# Altium project Rings.PrjPcb
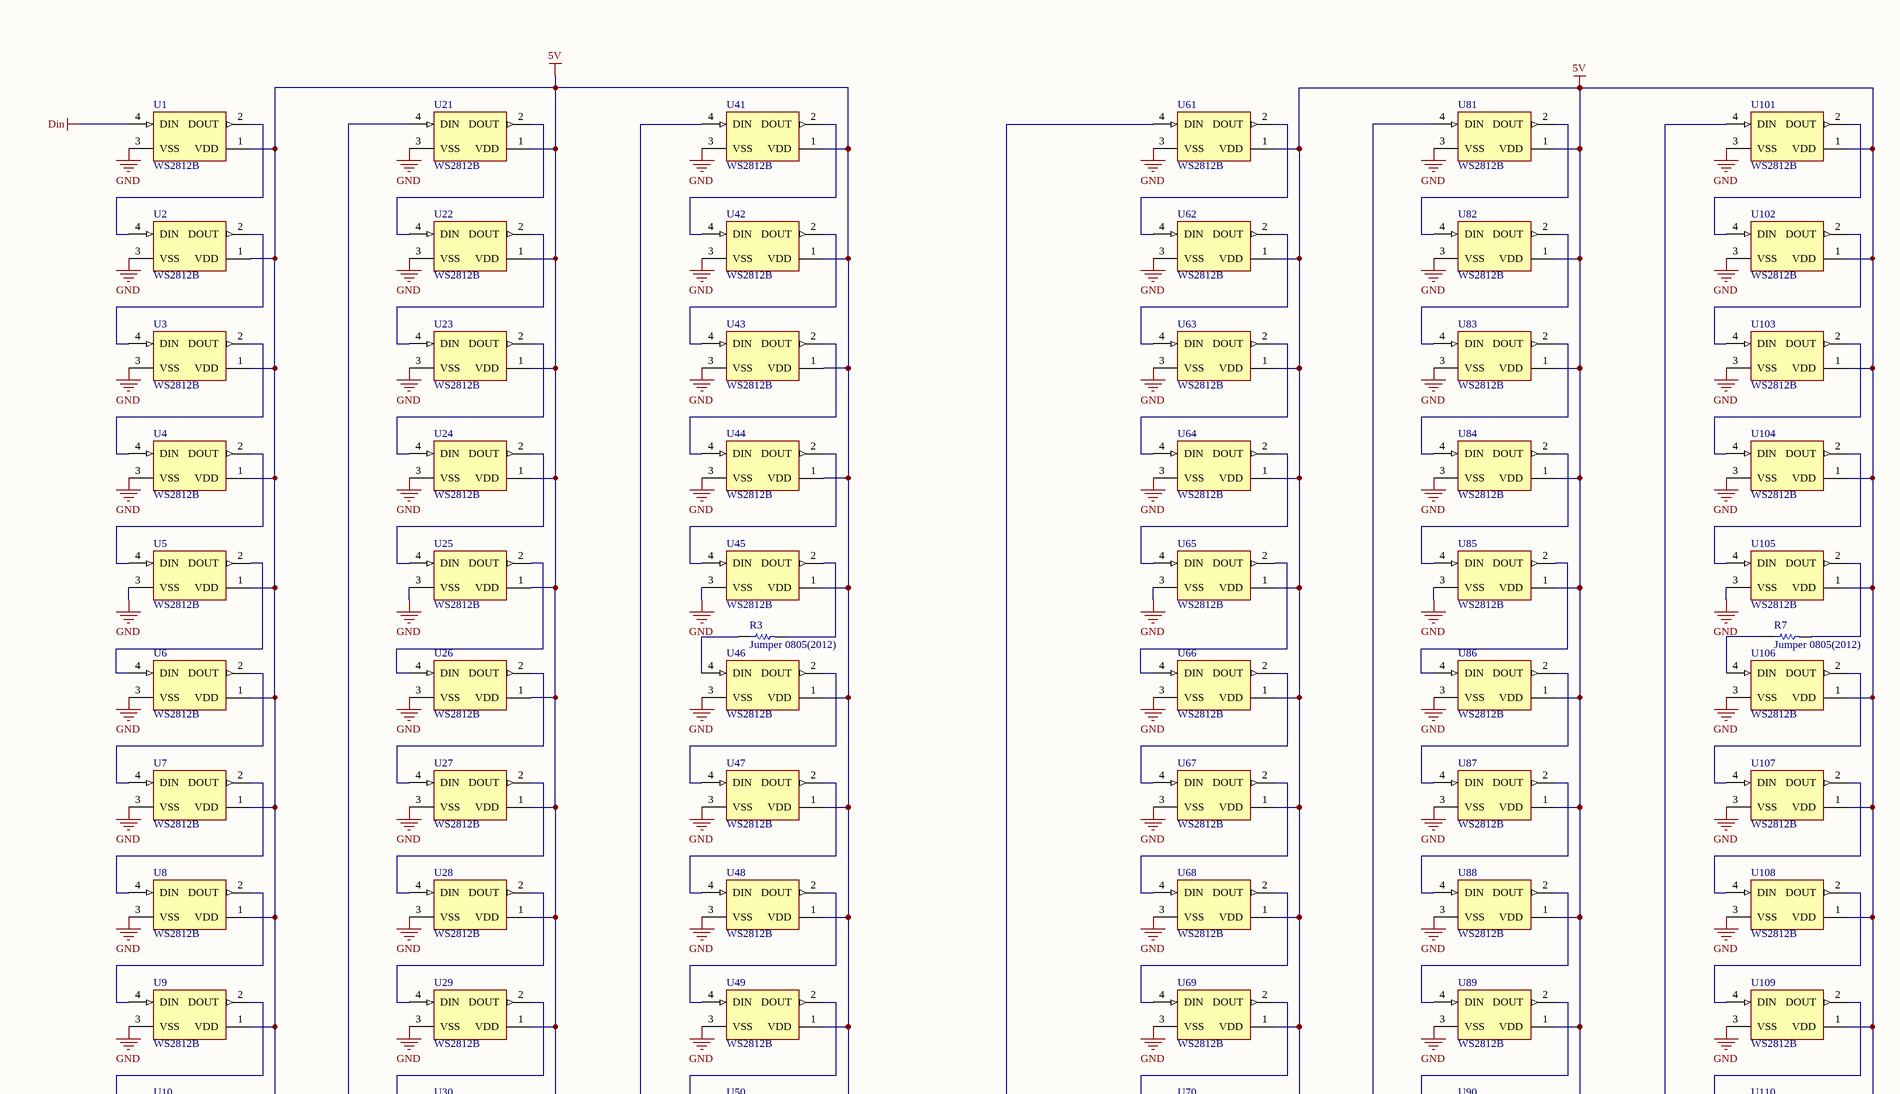
[diagram p0: ring.SchDoc, top left]
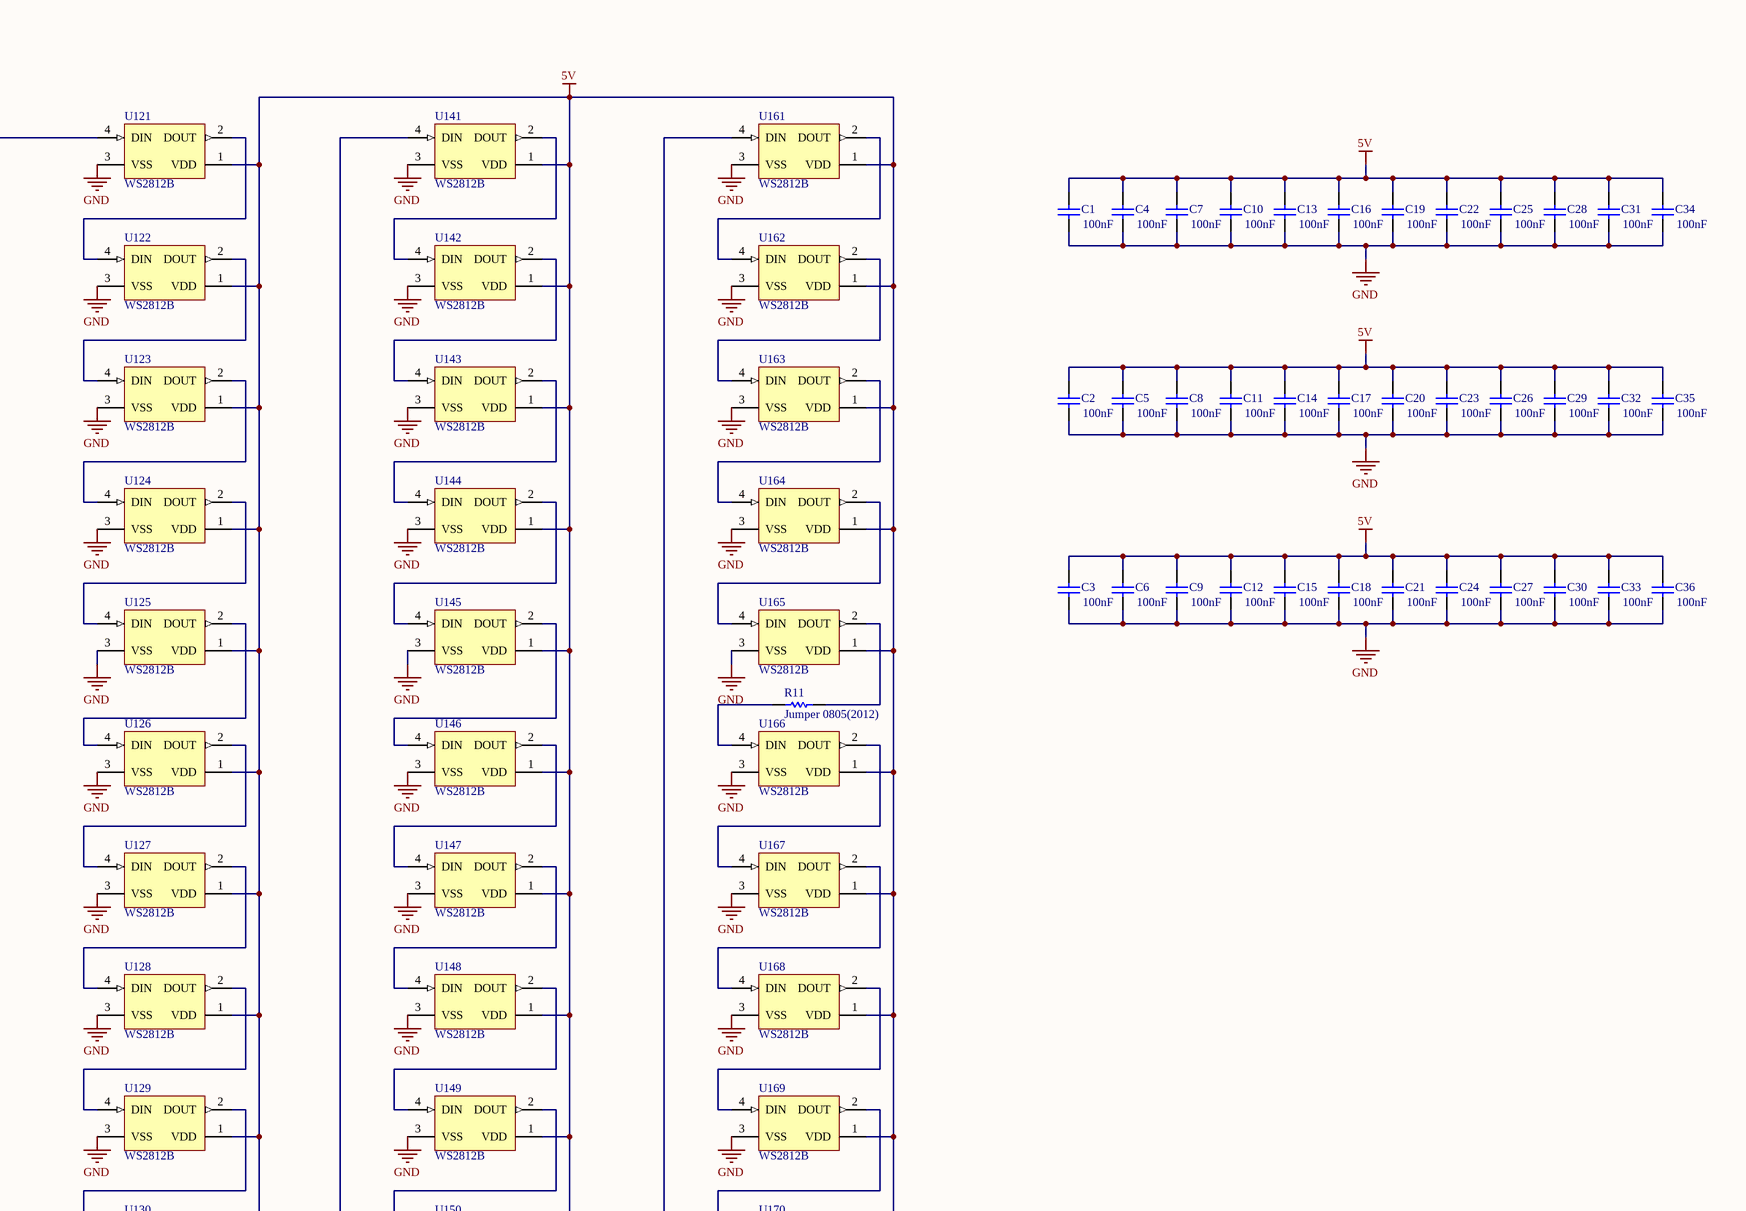
[diagram p1: ring.SchDoc, top right]
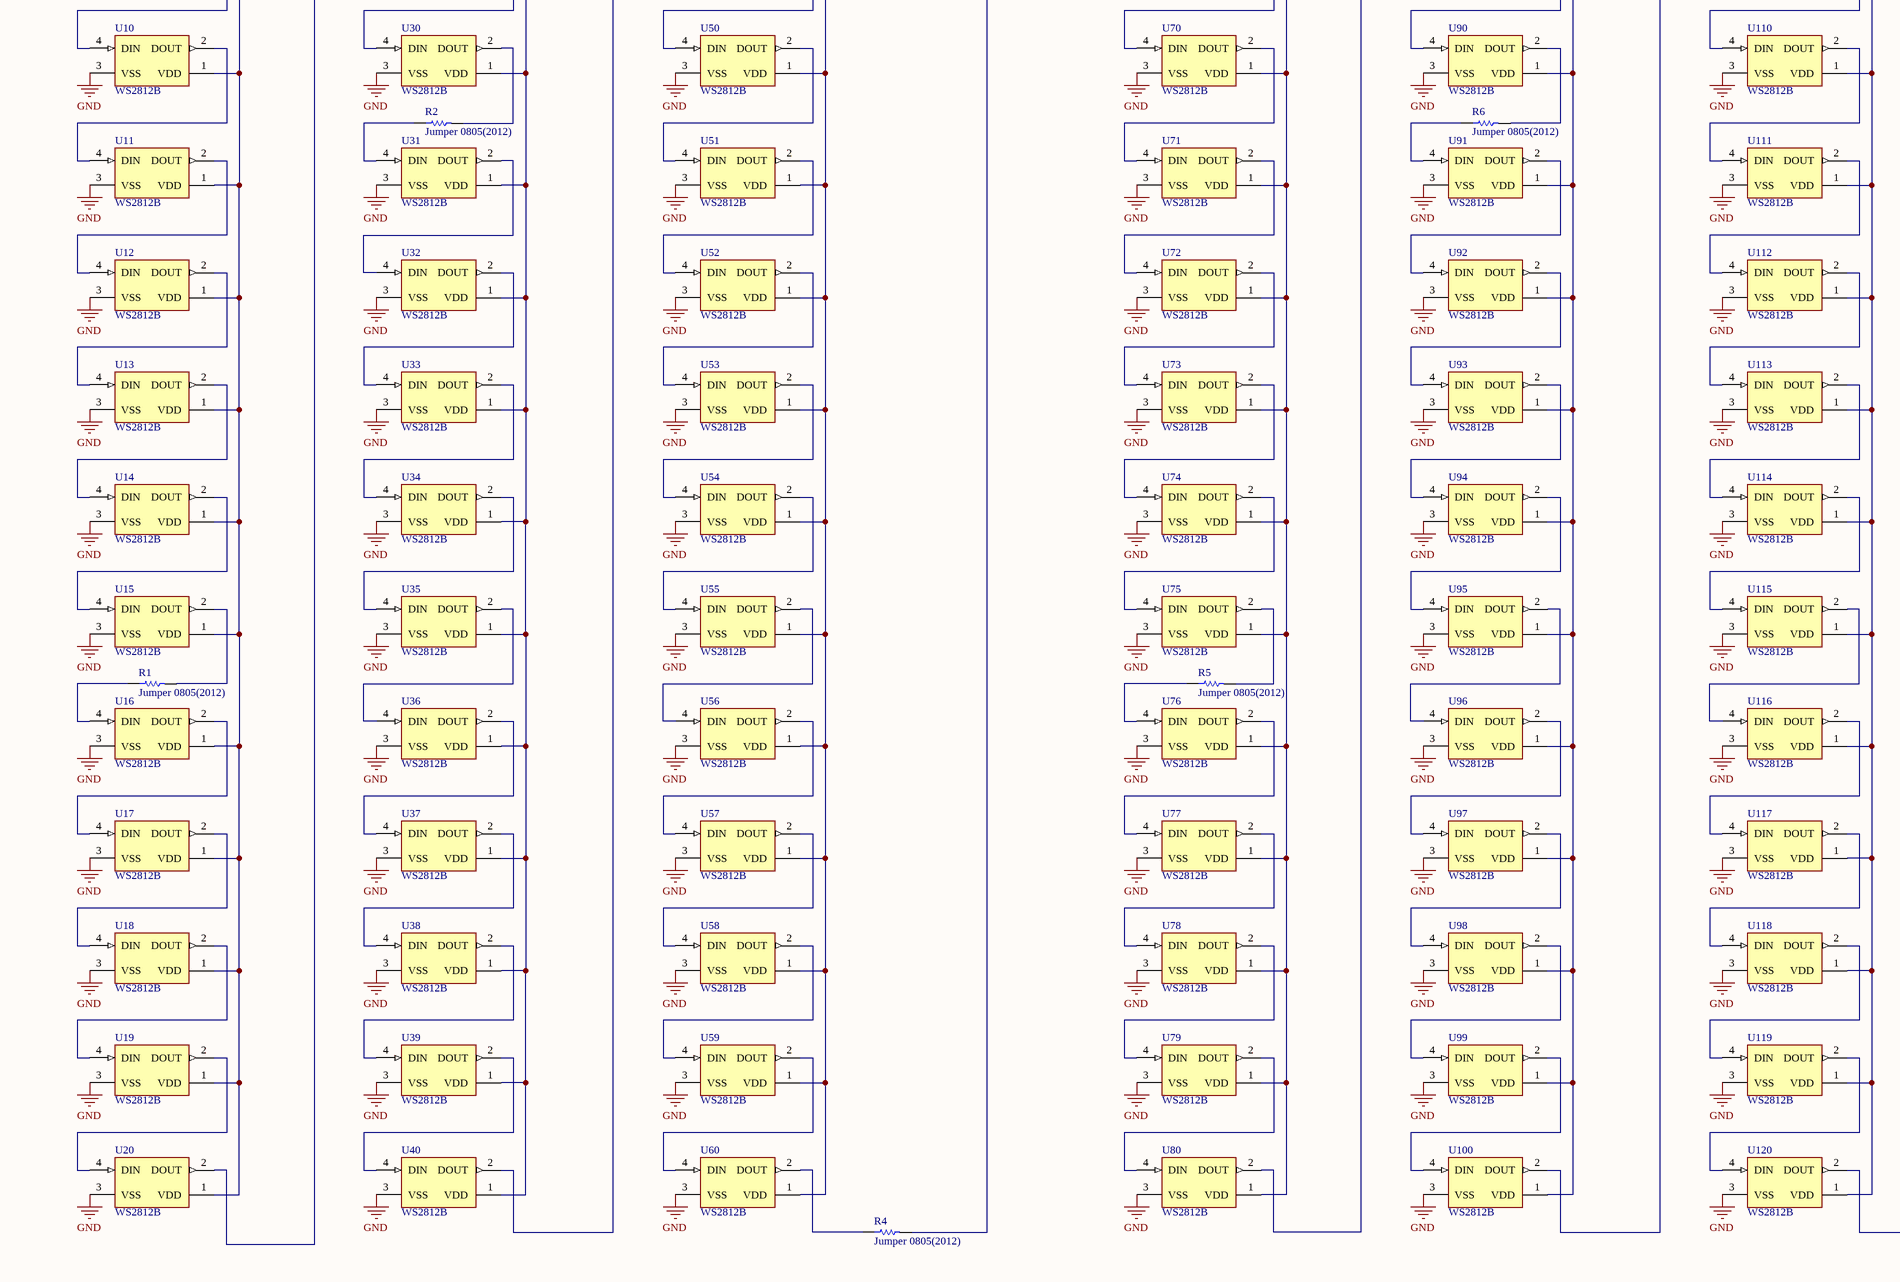
[diagram p2: ring.SchDoc, bottom left]
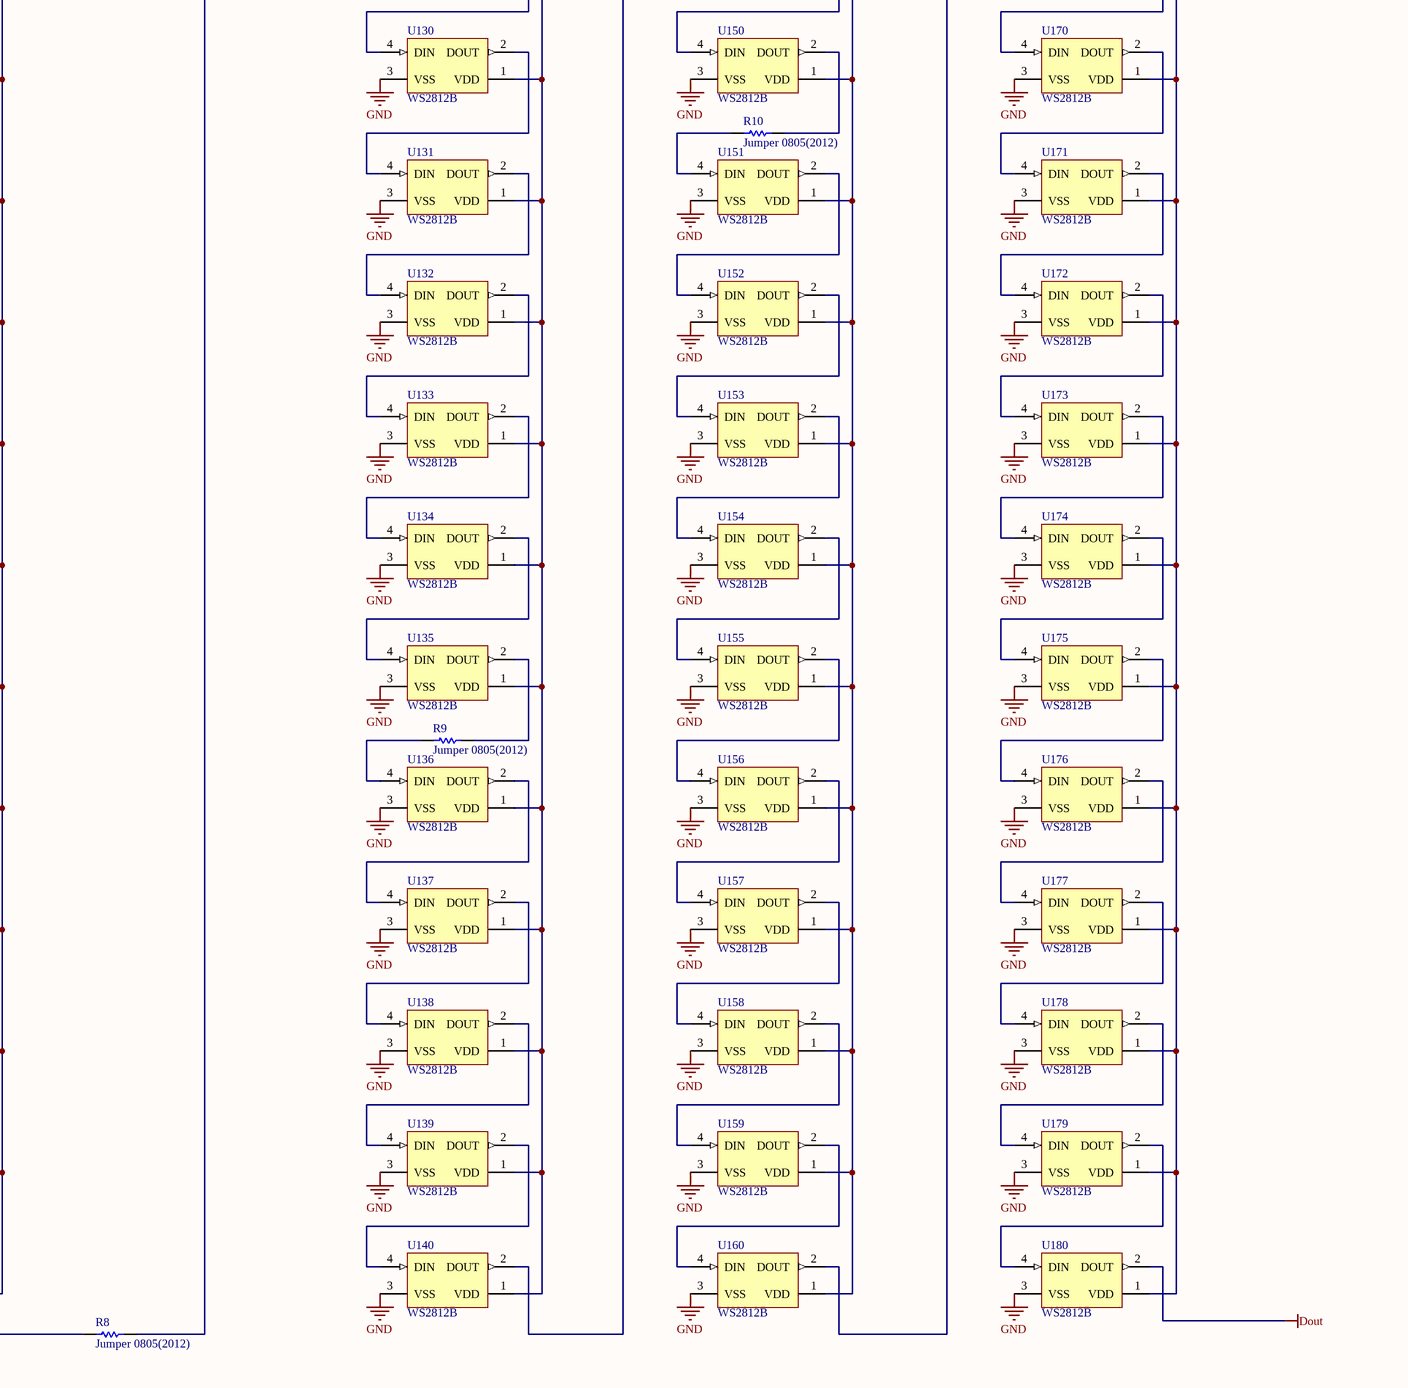
[diagram p3: ring.SchDoc, bottom right]
1 sheet, 227 parts. Net scope: global (net labels, ports and power ports of the same name join across sheets).
Board file: ring.PcbDoc

## Sheet ring.SchDoc: Rings
size A1; ApprovedBy: Othniel Konan; CheckedBy: Othniel Konan; Author: Othniel Konan; DrawnBy: Othniel Konan; Engineer: Othniel Konan; Address1: NPSC; Address2: Othniel Konan; Address3: ECE 2017; DocumentNumber: 1; Revision: 1.0; SheetNumber: 1; SheetTotal: 1; ProjectName: NPC

### Parts
C1  100nF  [CAPC0805(2012)100_N]
C2  100nF  [CAPC0805(2012)100_N]
C3  100nF  [CAPC0805(2012)100_N]
C4  100nF  [CAPC0805(2012)100_N]
C5  100nF  [CAPC0805(2012)100_N]
C6  100nF  [CAPC0805(2012)100_N]
C7  100nF  [CAPC0805(2012)100_N]
C8  100nF  [CAPC0805(2012)100_N]
C9  100nF  [CAPC0805(2012)100_N]
C10  100nF  [CAPC0805(2012)100_N]
C11  100nF  [CAPC0805(2012)100_N]
C12  100nF  [CAPC0805(2012)100_N]
C13  100nF  [CAPC0805(2012)100_N]
C14  100nF  [CAPC0805(2012)100_N]
C15  100nF  [CAPC0805(2012)100_N]
C16  100nF  [CAPC0805(2012)100_N]
C17  100nF  [CAPC0805(2012)100_N]
C18  100nF  [CAPC0805(2012)100_N]
C19  100nF  [CAPC0805(2012)100_N]
C20  100nF  [CAPC0805(2012)100_N]
C21  100nF  [CAPC0805(2012)100_N]
C22  100nF  [CAPC0805(2012)100_N]
C23  100nF  [CAPC0805(2012)100_N]
C24  100nF  [CAPC0805(2012)100_N]
C25  100nF  [CAPC0805(2012)100_N]
C26  100nF  [CAPC0805(2012)100_N]
C27  100nF  [CAPC0805(2012)100_N]
C28  100nF  [CAPC0805(2012)100_N]
C29  100nF  [CAPC0805(2012)100_N]
C30  100nF  [CAPC0805(2012)100_N]
C31  100nF  [CAPC0805(2012)100_N]
C32  100nF  [CAPC0805(2012)100_N]
C33  100nF  [CAPC0805(2012)100_N]
C34  100nF  [CAPC0805(2012)100_N]
C35  100nF  [CAPC0805(2012)100_N]
C36  100nF  [CAPC0805(2012)100_N]
R1  Jumper 0805(2012)  [RESC0805(2012)_N]
R2  Jumper 0805(2012)  [RESC0805(2012)_N]
R3  Jumper 0805(2012)  [RESC0805(2012)_N]
R4  Jumper 0805(2012)  [RESC0805(2012)_N]
R5  Jumper 0805(2012)  [RESC0805(2012)_N]
R6  Jumper 0805(2012)  [RESC0805(2012)_N]
R7  Jumper 0805(2012)  [RESC0805(2012)_N]
R8  Jumper 0805(2012)  [RESC0805(2012)_N]
R9  Jumper 0805(2012)  [RESC0805(2012)_N]
R10  Jumper 0805(2012)  [RESC0805(2012)_N]
R11  Jumper 0805(2012)  [RESC0805(2012)_N]
U1  WS2812B  [ADAI-WS2812B_V]
U2  WS2812B  [ADAI-WS2812B_V]
U3  WS2812B  [ADAI-WS2812B_V]
U4  WS2812B  [ADAI-WS2812B_V]
U5  WS2812B  [ADAI-WS2812B_V]
U6  WS2812B  [ADAI-WS2812B_V]
U7  WS2812B  [ADAI-WS2812B_V]
U8  WS2812B  [ADAI-WS2812B_V]
U9  WS2812B  [ADAI-WS2812B_V]
U10  WS2812B  [ADAI-WS2812B_V]
U11  WS2812B  [ADAI-WS2812B_V]
U12  WS2812B  [ADAI-WS2812B_V]
U13  WS2812B  [ADAI-WS2812B_V]
U14  WS2812B  [ADAI-WS2812B_V]
U15  WS2812B  [ADAI-WS2812B_V]
U16  WS2812B  [ADAI-WS2812B_V]
U17  WS2812B  [ADAI-WS2812B_V]
U18  WS2812B  [ADAI-WS2812B_V]
U19  WS2812B  [ADAI-WS2812B_V]
U20  WS2812B  [ADAI-WS2812B_V]
U21  WS2812B  [ADAI-WS2812B_V]
U22  WS2812B  [ADAI-WS2812B_V]
U23  WS2812B  [ADAI-WS2812B_V]
U24  WS2812B  [ADAI-WS2812B_V]
U25  WS2812B  [ADAI-WS2812B_V]
U26  WS2812B  [ADAI-WS2812B_V]
U27  WS2812B  [ADAI-WS2812B_V]
U28  WS2812B  [ADAI-WS2812B_V]
U29  WS2812B  [ADAI-WS2812B_V]
U30  WS2812B  [ADAI-WS2812B_V]
U31  WS2812B  [ADAI-WS2812B_V]
U32  WS2812B  [ADAI-WS2812B_V]
U33  WS2812B  [ADAI-WS2812B_V]
U34  WS2812B  [ADAI-WS2812B_V]
U35  WS2812B  [ADAI-WS2812B_V]
U36  WS2812B  [ADAI-WS2812B_V]
U37  WS2812B  [ADAI-WS2812B_V]
U38  WS2812B  [ADAI-WS2812B_V]
U39  WS2812B  [ADAI-WS2812B_V]
U40  WS2812B  [ADAI-WS2812B_V]
U41  WS2812B  [ADAI-WS2812B_V]
U42  WS2812B  [ADAI-WS2812B_V]
U43  WS2812B  [ADAI-WS2812B_V]
U44  WS2812B  [ADAI-WS2812B_V]
U45  WS2812B  [ADAI-WS2812B_V]
U46  WS2812B  [ADAI-WS2812B_V]
U47  WS2812B  [ADAI-WS2812B_V]
U48  WS2812B  [ADAI-WS2812B_V]
U49  WS2812B  [ADAI-WS2812B_V]
U50  WS2812B  [ADAI-WS2812B_V]
U51  WS2812B  [ADAI-WS2812B_V]
U52  WS2812B  [ADAI-WS2812B_V]
U53  WS2812B  [ADAI-WS2812B_V]
U54  WS2812B  [ADAI-WS2812B_V]
U55  WS2812B  [ADAI-WS2812B_V]
U56  WS2812B  [ADAI-WS2812B_V]
U57  WS2812B  [ADAI-WS2812B_V]
U58  WS2812B  [ADAI-WS2812B_V]
U59  WS2812B  [ADAI-WS2812B_V]
U60  WS2812B  [ADAI-WS2812B_V]
U61  WS2812B  [ADAI-WS2812B_V]
U62  WS2812B  [ADAI-WS2812B_V]
U63  WS2812B  [ADAI-WS2812B_V]
U64  WS2812B  [ADAI-WS2812B_V]
U65  WS2812B  [ADAI-WS2812B_V]
U66  WS2812B  [ADAI-WS2812B_V]
U67  WS2812B  [ADAI-WS2812B_V]
U68  WS2812B  [ADAI-WS2812B_V]
U69  WS2812B  [ADAI-WS2812B_V]
U70  WS2812B  [ADAI-WS2812B_V]
U71  WS2812B  [ADAI-WS2812B_V]
U72  WS2812B  [ADAI-WS2812B_V]
U73  WS2812B  [ADAI-WS2812B_V]
U74  WS2812B  [ADAI-WS2812B_V]
U75  WS2812B  [ADAI-WS2812B_V]
U76  WS2812B  [ADAI-WS2812B_V]
U77  WS2812B  [ADAI-WS2812B_V]
U78  WS2812B  [ADAI-WS2812B_V]
U79  WS2812B  [ADAI-WS2812B_V]
U80  WS2812B  [ADAI-WS2812B_V]
U81  WS2812B  [ADAI-WS2812B_V]
U82  WS2812B  [ADAI-WS2812B_V]
U83  WS2812B  [ADAI-WS2812B_V]
U84  WS2812B  [ADAI-WS2812B_V]
U85  WS2812B  [ADAI-WS2812B_V]
U86  WS2812B  [ADAI-WS2812B_V]
U87  WS2812B  [ADAI-WS2812B_V]
U88  WS2812B  [ADAI-WS2812B_V]
U89  WS2812B  [ADAI-WS2812B_V]
U90  WS2812B  [ADAI-WS2812B_V]
U91  WS2812B  [ADAI-WS2812B_V]
U92  WS2812B  [ADAI-WS2812B_V]
U93  WS2812B  [ADAI-WS2812B_V]
U94  WS2812B  [ADAI-WS2812B_V]
U95  WS2812B  [ADAI-WS2812B_V]
U96  WS2812B  [ADAI-WS2812B_V]
U97  WS2812B  [ADAI-WS2812B_V]
U98  WS2812B  [ADAI-WS2812B_V]
U99  WS2812B  [ADAI-WS2812B_V]
U100  WS2812B  [ADAI-WS2812B_V]
U101  WS2812B  [ADAI-WS2812B_V]
U102  WS2812B  [ADAI-WS2812B_V]
U103  WS2812B  [ADAI-WS2812B_V]
U104  WS2812B  [ADAI-WS2812B_V]
U105  WS2812B  [ADAI-WS2812B_V]
U106  WS2812B  [ADAI-WS2812B_V]
U107  WS2812B  [ADAI-WS2812B_V]
U108  WS2812B  [ADAI-WS2812B_V]
U109  WS2812B  [ADAI-WS2812B_V]
U110  WS2812B  [ADAI-WS2812B_V]
U111  WS2812B  [ADAI-WS2812B_V]
U112  WS2812B  [ADAI-WS2812B_V]
U113  WS2812B  [ADAI-WS2812B_V]
U114  WS2812B  [ADAI-WS2812B_V]
U115  WS2812B  [ADAI-WS2812B_V]
U116  WS2812B  [ADAI-WS2812B_V]
U117  WS2812B  [ADAI-WS2812B_V]
U118  WS2812B  [ADAI-WS2812B_V]
U119  WS2812B  [ADAI-WS2812B_V]
U120  WS2812B  [ADAI-WS2812B_V]
U121  WS2812B  [ADAI-WS2812B_V]
U122  WS2812B  [ADAI-WS2812B_V]
U123  WS2812B  [ADAI-WS2812B_V]
U124  WS2812B  [ADAI-WS2812B_V]
U125  WS2812B  [ADAI-WS2812B_V]
U126  WS2812B  [ADAI-WS2812B_V]
U127  WS2812B  [ADAI-WS2812B_V]
U128  WS2812B  [ADAI-WS2812B_V]
U129  WS2812B  [ADAI-WS2812B_V]
U130  WS2812B  [ADAI-WS2812B_V]
U131  WS2812B  [ADAI-WS2812B_V]
U132  WS2812B  [ADAI-WS2812B_V]
U133  WS2812B  [ADAI-WS2812B_V]
U134  WS2812B  [ADAI-WS2812B_V]
U135  WS2812B  [ADAI-WS2812B_V]
U136  WS2812B  [ADAI-WS2812B_V]
U137  WS2812B  [ADAI-WS2812B_V]
U138  WS2812B  [ADAI-WS2812B_V]
U139  WS2812B  [ADAI-WS2812B_V]
U140  WS2812B  [ADAI-WS2812B_V]
U141  WS2812B  [ADAI-WS2812B_V]
U142  WS2812B  [ADAI-WS2812B_V]
U143  WS2812B  [ADAI-WS2812B_V]
U144  WS2812B  [ADAI-WS2812B_V]
U145  WS2812B  [ADAI-WS2812B_V]
U146  WS2812B  [ADAI-WS2812B_V]
U147  WS2812B  [ADAI-WS2812B_V]
U148  WS2812B  [ADAI-WS2812B_V]
U149  WS2812B  [ADAI-WS2812B_V]
U150  WS2812B  [ADAI-WS2812B_V]
U151  WS2812B  [ADAI-WS2812B_V]
U152  WS2812B  [ADAI-WS2812B_V]
U153  WS2812B  [ADAI-WS2812B_V]
U154  WS2812B  [ADAI-WS2812B_V]
U155  WS2812B  [ADAI-WS2812B_V]
U156  WS2812B  [ADAI-WS2812B_V]
U157  WS2812B  [ADAI-WS2812B_V]
U158  WS2812B  [ADAI-WS2812B_V]
U159  WS2812B  [ADAI-WS2812B_V]
U160  WS2812B  [ADAI-WS2812B_V]
U161  WS2812B  [ADAI-WS2812B_V]
U162  WS2812B  [ADAI-WS2812B_V]
U163  WS2812B  [ADAI-WS2812B_V]
U164  WS2812B  [ADAI-WS2812B_V]
U165  WS2812B  [ADAI-WS2812B_V]
U166  WS2812B  [ADAI-WS2812B_V]
U167  WS2812B  [ADAI-WS2812B_V]
U168  WS2812B  [ADAI-WS2812B_V]
U169  WS2812B  [ADAI-WS2812B_V]
U170  WS2812B  [ADAI-WS2812B_V]
U171  WS2812B  [ADAI-WS2812B_V]
U172  WS2812B  [ADAI-WS2812B_V]
U173  WS2812B  [ADAI-WS2812B_V]
U174  WS2812B  [ADAI-WS2812B_V]
U175  WS2812B  [ADAI-WS2812B_V]
U176  WS2812B  [ADAI-WS2812B_V]
U177  WS2812B  [ADAI-WS2812B_V]
U178  WS2812B  [ADAI-WS2812B_V]
U179  WS2812B  [ADAI-WS2812B_V]
U180  WS2812B  [ADAI-WS2812B_V]

### Nets
5V: C1.2 C2.2 C3.2 C4.2 C5.2 C6.2 C7.2 C8.2 C9.2 C10.2 C11.2 C12.2 C13.2 C14.2 C15.2 C16.2 C17.2 C18.2 C19.2 C20.2 C21.2 C22.2 C23.2 C24.2 C25.2 C26.2 C27.2 C28.2 C29.2 C30.2 C31.2 C32.2 C33.2 C34.2 C35.2 C36.2 U1.1(VDD) U2.1(VDD) U3.1(VDD) U4.1(VDD) U5.1(VDD) U6.1(VDD) U7.1(VDD) U8.1(VDD) U9.1(VDD) U10.1(VDD) U11.1(VDD) U12.1(VDD) U13.1(VDD) U14.1(VDD) U15.1(VDD) U16.1(VDD) U17.1(VDD) U18.1(VDD) U19.1(VDD) U20.1(VDD) U21.1(VDD) U22.1(VDD) U23.1(VDD) U24.1(VDD) U25.1(VDD) U26.1(VDD) U27.1(VDD) U28.1(VDD) U29.1(VDD) U30.1(VDD) U31.1(VDD) U32.1(VDD) U33.1(VDD) U34.1(VDD) U35.1(VDD) U36.1(VDD) U37.1(VDD) U38.1(VDD) U39.1(VDD) U40.1(VDD) U41.1(VDD) U42.1(VDD) U43.1(VDD) U44.1(VDD) U45.1(VDD) U46.1(VDD) U47.1(VDD) U48.1(VDD) U49.1(VDD) U50.1(VDD) U51.1(VDD) U52.1(VDD) U53.1(VDD) U54.1(VDD) U55.1(VDD) U56.1(VDD) U57.1(VDD) U58.1(VDD) U59.1(VDD) U60.1(VDD) U61.1(VDD) U62.1(VDD) U63.1(VDD) U64.1(VDD) U65.1(VDD) U66.1(VDD) U67.1(VDD) U68.1(VDD) U69.1(VDD) U70.1(VDD) U71.1(VDD) U72.1(VDD) U73.1(VDD) U74.1(VDD) U75.1(VDD) U76.1(VDD) U77.1(VDD) U78.1(VDD) U79.1(VDD) U80.1(VDD) U81.1(VDD) U82.1(VDD) U83.1(VDD) U84.1(VDD) U85.1(VDD) U86.1(VDD) U87.1(VDD) U88.1(VDD) U89.1(VDD) U90.1(VDD) U91.1(VDD) U92.1(VDD) U93.1(VDD) U94.1(VDD) U95.1(VDD) U96.1(VDD) U97.1(VDD) U98.1(VDD) U99.1(VDD) U100.1(VDD) U101.1(VDD) U102.1(VDD) U103.1(VDD) U104.1(VDD) U105.1(VDD) U106.1(VDD) U107.1(VDD) U108.1(VDD) U109.1(VDD) U110.1(VDD) U111.1(VDD) U112.1(VDD) U113.1(VDD) U114.1(VDD) U115.1(VDD) U116.1(VDD) U117.1(VDD) U118.1(VDD) U119.1(VDD) U120.1(VDD) U121.1(VDD) U122.1(VDD) U123.1(VDD) U124.1(VDD) U125.1(VDD) U126.1(VDD) U127.1(VDD) U128.1(VDD) U129.1(VDD) U130.1(VDD) U131.1(VDD) U132.1(VDD) U133.1(VDD) U134.1(VDD) U135.1(VDD) U136.1(VDD) U137.1(VDD) U138.1(VDD) U139.1(VDD) U140.1(VDD) U141.1(VDD) U142.1(VDD) U143.1(VDD) U144.1(VDD) U145.1(VDD) U146.1(VDD) U147.1(VDD) U148.1(VDD) U149.1(VDD) U150.1(VDD) U151.1(VDD) U152.1(VDD) U153.1(VDD) U154.1(VDD) U155.1(VDD) U156.1(VDD) U157.1(VDD) U158.1(VDD) U159.1(VDD) U160.1(VDD) U161.1(VDD) U162.1(VDD) U163.1(VDD) U164.1(VDD) U165.1(VDD) U166.1(VDD) U167.1(VDD) U168.1(VDD) U169.1(VDD) U170.1(VDD) U171.1(VDD) U172.1(VDD) U173.1(VDD) U174.1(VDD) U175.1(VDD) U176.1(VDD) U177.1(VDD) U178.1(VDD) U179.1(VDD) U180.1(VDD)
Din: U1.4(DIN)
Dout: U180.2(DOUT)
GND: C1.1 C2.1 C3.1 C4.1 C5.1 C6.1 C7.1 C8.1 C9.1 C10.1 C11.1 C12.1 C13.1 C14.1 C15.1 C16.1 C17.1 C18.1 C19.1 C20.1 C21.1 C22.1 C23.1 C24.1 C25.1 C26.1 C27.1 C28.1 C29.1 C30.1 C31.1 C32.1 C33.1 C34.1 C35.1 C36.1 U1.3(VSS) U2.3(VSS) U3.3(VSS) U4.3(VSS) U5.3(VSS) U6.3(VSS) U7.3(VSS) U8.3(VSS) U9.3(VSS) U10.3(VSS) U11.3(VSS) U12.3(VSS) U13.3(VSS) U14.3(VSS) U15.3(VSS) U16.3(VSS) U17.3(VSS) U18.3(VSS) U19.3(VSS) U20.3(VSS) U21.3(VSS) U22.3(VSS) U23.3(VSS) U24.3(VSS) U25.3(VSS) U26.3(VSS) U27.3(VSS) U28.3(VSS) U29.3(VSS) U30.3(VSS) U31.3(VSS) U32.3(VSS) U33.3(VSS) U34.3(VSS) U35.3(VSS) U36.3(VSS) U37.3(VSS) U38.3(VSS) U39.3(VSS) U40.3(VSS) U41.3(VSS) U42.3(VSS) U43.3(VSS) U44.3(VSS) U45.3(VSS) U46.3(VSS) U47.3(VSS) U48.3(VSS) U49.3(VSS) U50.3(VSS) U51.3(VSS) U52.3(VSS) U53.3(VSS) U54.3(VSS) U55.3(VSS) U56.3(VSS) U57.3(VSS) U58.3(VSS) U59.3(VSS) U60.3(VSS) U61.3(VSS) U62.3(VSS) U63.3(VSS) U64.3(VSS) U65.3(VSS) U66.3(VSS) U67.3(VSS) U68.3(VSS) U69.3(VSS) U70.3(VSS) U71.3(VSS) U72.3(VSS) U73.3(VSS) U74.3(VSS) U75.3(VSS) U76.3(VSS) U77.3(VSS) U78.3(VSS) U79.3(VSS) U80.3(VSS) U81.3(VSS) U82.3(VSS) U83.3(VSS) U84.3(VSS) U85.3(VSS) U86.3(VSS) U87.3(VSS) U88.3(VSS) U89.3(VSS) U90.3(VSS) U91.3(VSS) U92.3(VSS) U93.3(VSS) U94.3(VSS) U95.3(VSS) U96.3(VSS) U97.3(VSS) U98.3(VSS) U99.3(VSS) U100.3(VSS) U101.3(VSS) U102.3(VSS) U103.3(VSS) U104.3(VSS) U105.3(VSS) U106.3(VSS) U107.3(VSS) U108.3(VSS) U109.3(VSS) U110.3(VSS) U111.3(VSS) U112.3(VSS) U113.3(VSS) U114.3(VSS) U115.3(VSS) U116.3(VSS) U117.3(VSS) U118.3(VSS) U119.3(VSS) U120.3(VSS) U121.3(VSS) U122.3(VSS) U123.3(VSS) U124.3(VSS) U125.3(VSS) U126.3(VSS) U127.3(VSS) U128.3(VSS) U129.3(VSS) U130.3(VSS) U131.3(VSS) U132.3(VSS) U133.3(VSS) U134.3(VSS) U135.3(VSS) U136.3(VSS) U137.3(VSS) U138.3(VSS) U139.3(VSS) U140.3(VSS) U141.3(VSS) U142.3(VSS) U143.3(VSS) U144.3(VSS) U145.3(VSS) U146.3(VSS) U147.3(VSS) U148.3(VSS) U149.3(VSS) U150.3(VSS) U151.3(VSS) U152.3(VSS) U153.3(VSS) U154.3(VSS) U155.3(VSS) U156.3(VSS) U157.3(VSS) U158.3(VSS) U159.3(VSS) U160.3(VSS) U161.3(VSS) U162.3(VSS) U163.3(VSS) U164.3(VSS) U165.3(VSS) U166.3(VSS) U167.3(VSS) U168.3(VSS) U169.3(VSS) U170.3(VSS) U171.3(VSS) U172.3(VSS) U173.3(VSS) U174.3(VSS) U175.3(VSS) U176.3(VSS) U177.3(VSS) U178.3(VSS) U179.3(VSS) U180.3(VSS)
NetR1_1: R1.1 U16.4(DIN)
NetR1_2: R1.2 U15.2(DOUT)
NetR2_1: R2.1 U31.4(DIN)
NetR2_2: R2.2 U30.2(DOUT)
NetR3_1: R3.1 U46.4(DIN)
NetR3_2: R3.2 U45.2(DOUT)
NetR4_1: R4.1 U60.2(DOUT)
NetR4_2: R4.2 U61.4(DIN)
NetR5_1: R5.1 U76.4(DIN)
NetR5_2: R5.2 U75.2(DOUT)
NetR6_1: R6.1 U91.4(DIN)
NetR6_2: R6.2 U90.2(DOUT)
NetR7_1: R7.1 U106.4(DIN)
NetR7_2: R7.2 U105.2(DOUT)
NetR8_1: R8.1 U120.2(DOUT)
NetR8_2: R8.2 U121.4(DIN)
NetR9_1: R9.1 U136.4(DIN)
NetR9_2: R9.2 U135.2(DOUT)
NetR10_1: R10.1 U151.4(DIN)
NetR10_2: R10.2 U150.2(DOUT)
NetR11_1: R11.1 U166.4(DIN)
NetR11_2: R11.2 U165.2(DOUT)
NetU1_2: U1.2(DOUT) U2.4(DIN)
NetU2_2: U2.2(DOUT) U3.4(DIN)
NetU3_2: U3.2(DOUT) U4.4(DIN)
NetU4_2: U4.2(DOUT) U5.4(DIN)
NetU5_2: U5.2(DOUT) U6.4(DIN)
NetU6_2: U6.2(DOUT) U7.4(DIN)
NetU7_2: U7.2(DOUT) U8.4(DIN)
NetU8_2: U8.2(DOUT) U9.4(DIN)
NetU9_2: U9.2(DOUT) U10.4(DIN)
NetU10_2: U10.2(DOUT) U11.4(DIN)
NetU11_2: U11.2(DOUT) U12.4(DIN)
NetU12_2: U12.2(DOUT) U13.4(DIN)
NetU13_2: U13.2(DOUT) U14.4(DIN)
NetU14_2: U14.2(DOUT) U15.4(DIN)
NetU16_2: U16.2(DOUT) U17.4(DIN)
NetU17_2: U17.2(DOUT) U18.4(DIN)
NetU18_2: U18.2(DOUT) U19.4(DIN)
NetU19_2: U19.2(DOUT) U20.4(DIN)
NetU20_2: U20.2(DOUT) U21.4(DIN)
NetU21_2: U21.2(DOUT) U22.4(DIN)
NetU22_2: U22.2(DOUT) U23.4(DIN)
NetU23_2: U23.2(DOUT) U24.4(DIN)
NetU24_2: U24.2(DOUT) U25.4(DIN)
NetU25_2: U25.2(DOUT) U26.4(DIN)
NetU26_2: U26.2(DOUT) U27.4(DIN)
NetU27_2: U27.2(DOUT) U28.4(DIN)
NetU28_2: U28.2(DOUT) U29.4(DIN)
NetU29_2: U29.2(DOUT) U30.4(DIN)
NetU31_2: U31.2(DOUT) U32.4(DIN)
NetU32_2: U32.2(DOUT) U33.4(DIN)
NetU33_2: U33.2(DOUT) U34.4(DIN)
NetU34_2: U34.2(DOUT) U35.4(DIN)
NetU35_2: U35.2(DOUT) U36.4(DIN)
NetU36_2: U36.2(DOUT) U37.4(DIN)
NetU37_2: U37.2(DOUT) U38.4(DIN)
NetU38_2: U38.2(DOUT) U39.4(DIN)
NetU39_2: U39.2(DOUT) U40.4(DIN)
NetU40_2: U40.2(DOUT) U41.4(DIN)
NetU41_2: U41.2(DOUT) U42.4(DIN)
NetU42_2: U42.2(DOUT) U43.4(DIN)
NetU43_2: U43.2(DOUT) U44.4(DIN)
NetU44_2: U44.2(DOUT) U45.4(DIN)
NetU46_2: U46.2(DOUT) U47.4(DIN)
NetU47_2: U47.2(DOUT) U48.4(DIN)
NetU48_2: U48.2(DOUT) U49.4(DIN)
NetU49_2: U49.2(DOUT) U50.4(DIN)
NetU50_2: U50.2(DOUT) U51.4(DIN)
NetU51_2: U51.2(DOUT) U52.4(DIN)
NetU52_2: U52.2(DOUT) U53.4(DIN)
NetU53_2: U53.2(DOUT) U54.4(DIN)
NetU54_2: U54.2(DOUT) U55.4(DIN)
NetU55_2: U55.2(DOUT) U56.4(DIN)
NetU56_2: U56.2(DOUT) U57.4(DIN)
NetU57_2: U57.2(DOUT) U58.4(DIN)
NetU58_2: U58.2(DOUT) U59.4(DIN)
NetU59_2: U59.2(DOUT) U60.4(DIN)
NetU61_2: U61.2(DOUT) U62.4(DIN)
NetU62_2: U62.2(DOUT) U63.4(DIN)
NetU63_2: U63.2(DOUT) U64.4(DIN)
NetU64_2: U64.2(DOUT) U65.4(DIN)
NetU65_2: U65.2(DOUT) U66.4(DIN)
NetU66_2: U66.2(DOUT) U67.4(DIN)
NetU67_2: U67.2(DOUT) U68.4(DIN)
NetU68_2: U68.2(DOUT) U69.4(DIN)
NetU69_2: U69.2(DOUT) U70.4(DIN)
NetU70_2: U70.2(DOUT) U71.4(DIN)
NetU71_2: U71.2(DOUT) U72.4(DIN)
NetU72_2: U72.2(DOUT) U73.4(DIN)
NetU73_2: U73.2(DOUT) U74.4(DIN)
NetU74_2: U74.2(DOUT) U75.4(DIN)
NetU76_2: U76.2(DOUT) U77.4(DIN)
NetU77_2: U77.2(DOUT) U78.4(DIN)
NetU78_2: U78.2(DOUT) U79.4(DIN)
NetU79_2: U79.2(DOUT) U80.4(DIN)
NetU80_2: U80.2(DOUT) U81.4(DIN)
NetU81_2: U81.2(DOUT) U82.4(DIN)
NetU82_2: U82.2(DOUT) U83.4(DIN)
NetU83_2: U83.2(DOUT) U84.4(DIN)
NetU84_2: U84.2(DOUT) U85.4(DIN)
NetU85_2: U85.2(DOUT) U86.4(DIN)
NetU86_2: U86.2(DOUT) U87.4(DIN)
NetU87_2: U87.2(DOUT) U88.4(DIN)
NetU88_2: U88.2(DOUT) U89.4(DIN)
NetU89_2: U89.2(DOUT) U90.4(DIN)
NetU91_2: U91.2(DOUT) U92.4(DIN)
NetU92_2: U92.2(DOUT) U93.4(DIN)
NetU93_2: U93.2(DOUT) U94.4(DIN)
NetU94_2: U94.2(DOUT) U95.4(DIN)
NetU95_2: U95.2(DOUT) U96.4(DIN)
NetU96_2: U96.2(DOUT) U97.4(DIN)
NetU97_2: U97.2(DOUT) U98.4(DIN)
NetU98_2: U98.2(DOUT) U99.4(DIN)
NetU99_2: U99.2(DOUT) U100.4(DIN)
NetU100_2: U100.2(DOUT) U101.4(DIN)
NetU101_2: U101.2(DOUT) U102.4(DIN)
NetU102_2: U102.2(DOUT) U103.4(DIN)
NetU103_2: U103.2(DOUT) U104.4(DIN)
NetU104_2: U104.2(DOUT) U105.4(DIN)
NetU106_2: U106.2(DOUT) U107.4(DIN)
NetU107_2: U107.2(DOUT) U108.4(DIN)
NetU108_2: U108.2(DOUT) U109.4(DIN)
NetU109_2: U109.2(DOUT) U110.4(DIN)
NetU110_2: U110.2(DOUT) U111.4(DIN)
NetU111_2: U111.2(DOUT) U112.4(DIN)
NetU112_2: U112.2(DOUT) U113.4(DIN)
NetU113_2: U113.2(DOUT) U114.4(DIN)
NetU114_2: U114.2(DOUT) U115.4(DIN)
NetU115_2: U115.2(DOUT) U116.4(DIN)
NetU116_2: U116.2(DOUT) U117.4(DIN)
NetU117_2: U117.2(DOUT) U118.4(DIN)
NetU118_2: U118.2(DOUT) U119.4(DIN)
NetU119_2: U119.2(DOUT) U120.4(DIN)
NetU121_2: U121.2(DOUT) U122.4(DIN)
NetU122_2: U122.2(DOUT) U123.4(DIN)
NetU123_2: U123.2(DOUT) U124.4(DIN)
NetU124_2: U124.2(DOUT) U125.4(DIN)
NetU125_2: U125.2(DOUT) U126.4(DIN)
NetU126_2: U126.2(DOUT) U127.4(DIN)
NetU127_2: U127.2(DOUT) U128.4(DIN)
NetU128_2: U128.2(DOUT) U129.4(DIN)
NetU129_2: U129.2(DOUT) U130.4(DIN)
NetU130_2: U130.2(DOUT) U131.4(DIN)
NetU131_2: U131.2(DOUT) U132.4(DIN)
NetU132_2: U132.2(DOUT) U133.4(DIN)
NetU133_2: U133.2(DOUT) U134.4(DIN)
NetU134_2: U134.2(DOUT) U135.4(DIN)
NetU136_2: U136.2(DOUT) U137.4(DIN)
NetU137_2: U137.2(DOUT) U138.4(DIN)
NetU138_2: U138.2(DOUT) U139.4(DIN)
NetU139_2: U139.2(DOUT) U140.4(DIN)
NetU140_2: U140.2(DOUT) U141.4(DIN)
NetU141_2: U141.2(DOUT) U142.4(DIN)
NetU142_2: U142.2(DOUT) U143.4(DIN)
NetU143_2: U143.2(DOUT) U144.4(DIN)
NetU144_2: U144.2(DOUT) U145.4(DIN)
NetU145_2: U145.2(DOUT) U146.4(DIN)
NetU146_2: U146.2(DOUT) U147.4(DIN)
NetU147_2: U147.2(DOUT) U148.4(DIN)
NetU148_2: U148.2(DOUT) U149.4(DIN)
NetU149_2: U149.2(DOUT) U150.4(DIN)
NetU151_2: U151.2(DOUT) U152.4(DIN)
NetU152_2: U152.2(DOUT) U153.4(DIN)
NetU153_2: U153.2(DOUT) U154.4(DIN)
NetU154_2: U154.2(DOUT) U155.4(DIN)
NetU155_2: U155.2(DOUT) U156.4(DIN)
NetU156_2: U156.2(DOUT) U157.4(DIN)
NetU157_2: U157.2(DOUT) U158.4(DIN)
NetU158_2: U158.2(DOUT) U159.4(DIN)
NetU159_2: U159.2(DOUT) U160.4(DIN)
NetU160_2: U160.2(DOUT) U161.4(DIN)
NetU161_2: U161.2(DOUT) U162.4(DIN)
NetU162_2: U162.2(DOUT) U163.4(DIN)
NetU163_2: U163.2(DOUT) U164.4(DIN)
NetU164_2: U164.2(DOUT) U165.4(DIN)
NetU166_2: U166.2(DOUT) U167.4(DIN)
NetU167_2: U167.2(DOUT) U168.4(DIN)
NetU168_2: U168.2(DOUT) U169.4(DIN)
NetU169_2: U169.2(DOUT) U170.4(DIN)
NetU170_2: U170.2(DOUT) U171.4(DIN)
NetU171_2: U171.2(DOUT) U172.4(DIN)
NetU172_2: U172.2(DOUT) U173.4(DIN)
NetU173_2: U173.2(DOUT) U174.4(DIN)
NetU174_2: U174.2(DOUT) U175.4(DIN)
NetU175_2: U175.2(DOUT) U176.4(DIN)
NetU176_2: U176.2(DOUT) U177.4(DIN)
NetU177_2: U177.2(DOUT) U178.4(DIN)
NetU178_2: U178.2(DOUT) U179.4(DIN)
NetU179_2: U179.2(DOUT) U180.4(DIN)

### Notes on the sheet
- Title
- Size:
- Date:
- File:
- A1
- Number:
- Time:
- Revision:
- Sheet
- of

### Library data of the parts
C1-C36 = CMP-1036-04396-1: CAP 100nF 10V ±20% 0805 (2012 Metric) Thickness 1mm SMD; Tolerance: Â±20%; Case-Metric: 2012; Case-EIA: 0805; Value: 100nF; Rated Voltage: 10 V; Technology: SMT; Max Thickness: 1 mm
R1-R11 = CMP-1013-00001-1: Jumper 0805 (2012 Metric); Case-EIA: 0805; Power: None; Case-Metric: 2012; Value: 0.00 Ohm; Technology: SMT; Tolerance: None
U1-U180 = CMP-1740-00005-1: Intelligent Control LED Integrated Light Source, 3.5 to 5.3 V, -25 to 80 degC, 4-Pin SMD, RoHS, Bulk; Case\Package: Radial; Shielding: Unshielded; Current Rating: 240 mA; Tolerance: 10%; Mount: Through Hole; Max Operating Temperature: 125 degC; Radiation Hardening: No; Length: 12.2 mm; Min Operating Temperature: -55 degC; ComponentLink1URL: https://www.adafruit.com/; Packaging: Bulk; Lead Pitch: 5 mm; RoHSCompliant: true; Pins: 2; Package Quantity: 200; ComponentLink2URL: https://cdn-shop.adafruit.com/datasheets/WS2812B.pdf; ComponentLink2Description: Datasheet; PackageDescription: 4-Pin Surface Mount Device, Body 5 x 5 mm, Pitch 3.3 mm; PackageReference: WS2812B; Height: 12.2 mm; REACH SVHC: No SVHC; ComponentLink1Description: Manufacturer URL; DatasheetVersion: May-13